# EAGLE design BQ25798 (EAGLE 9.6.2)
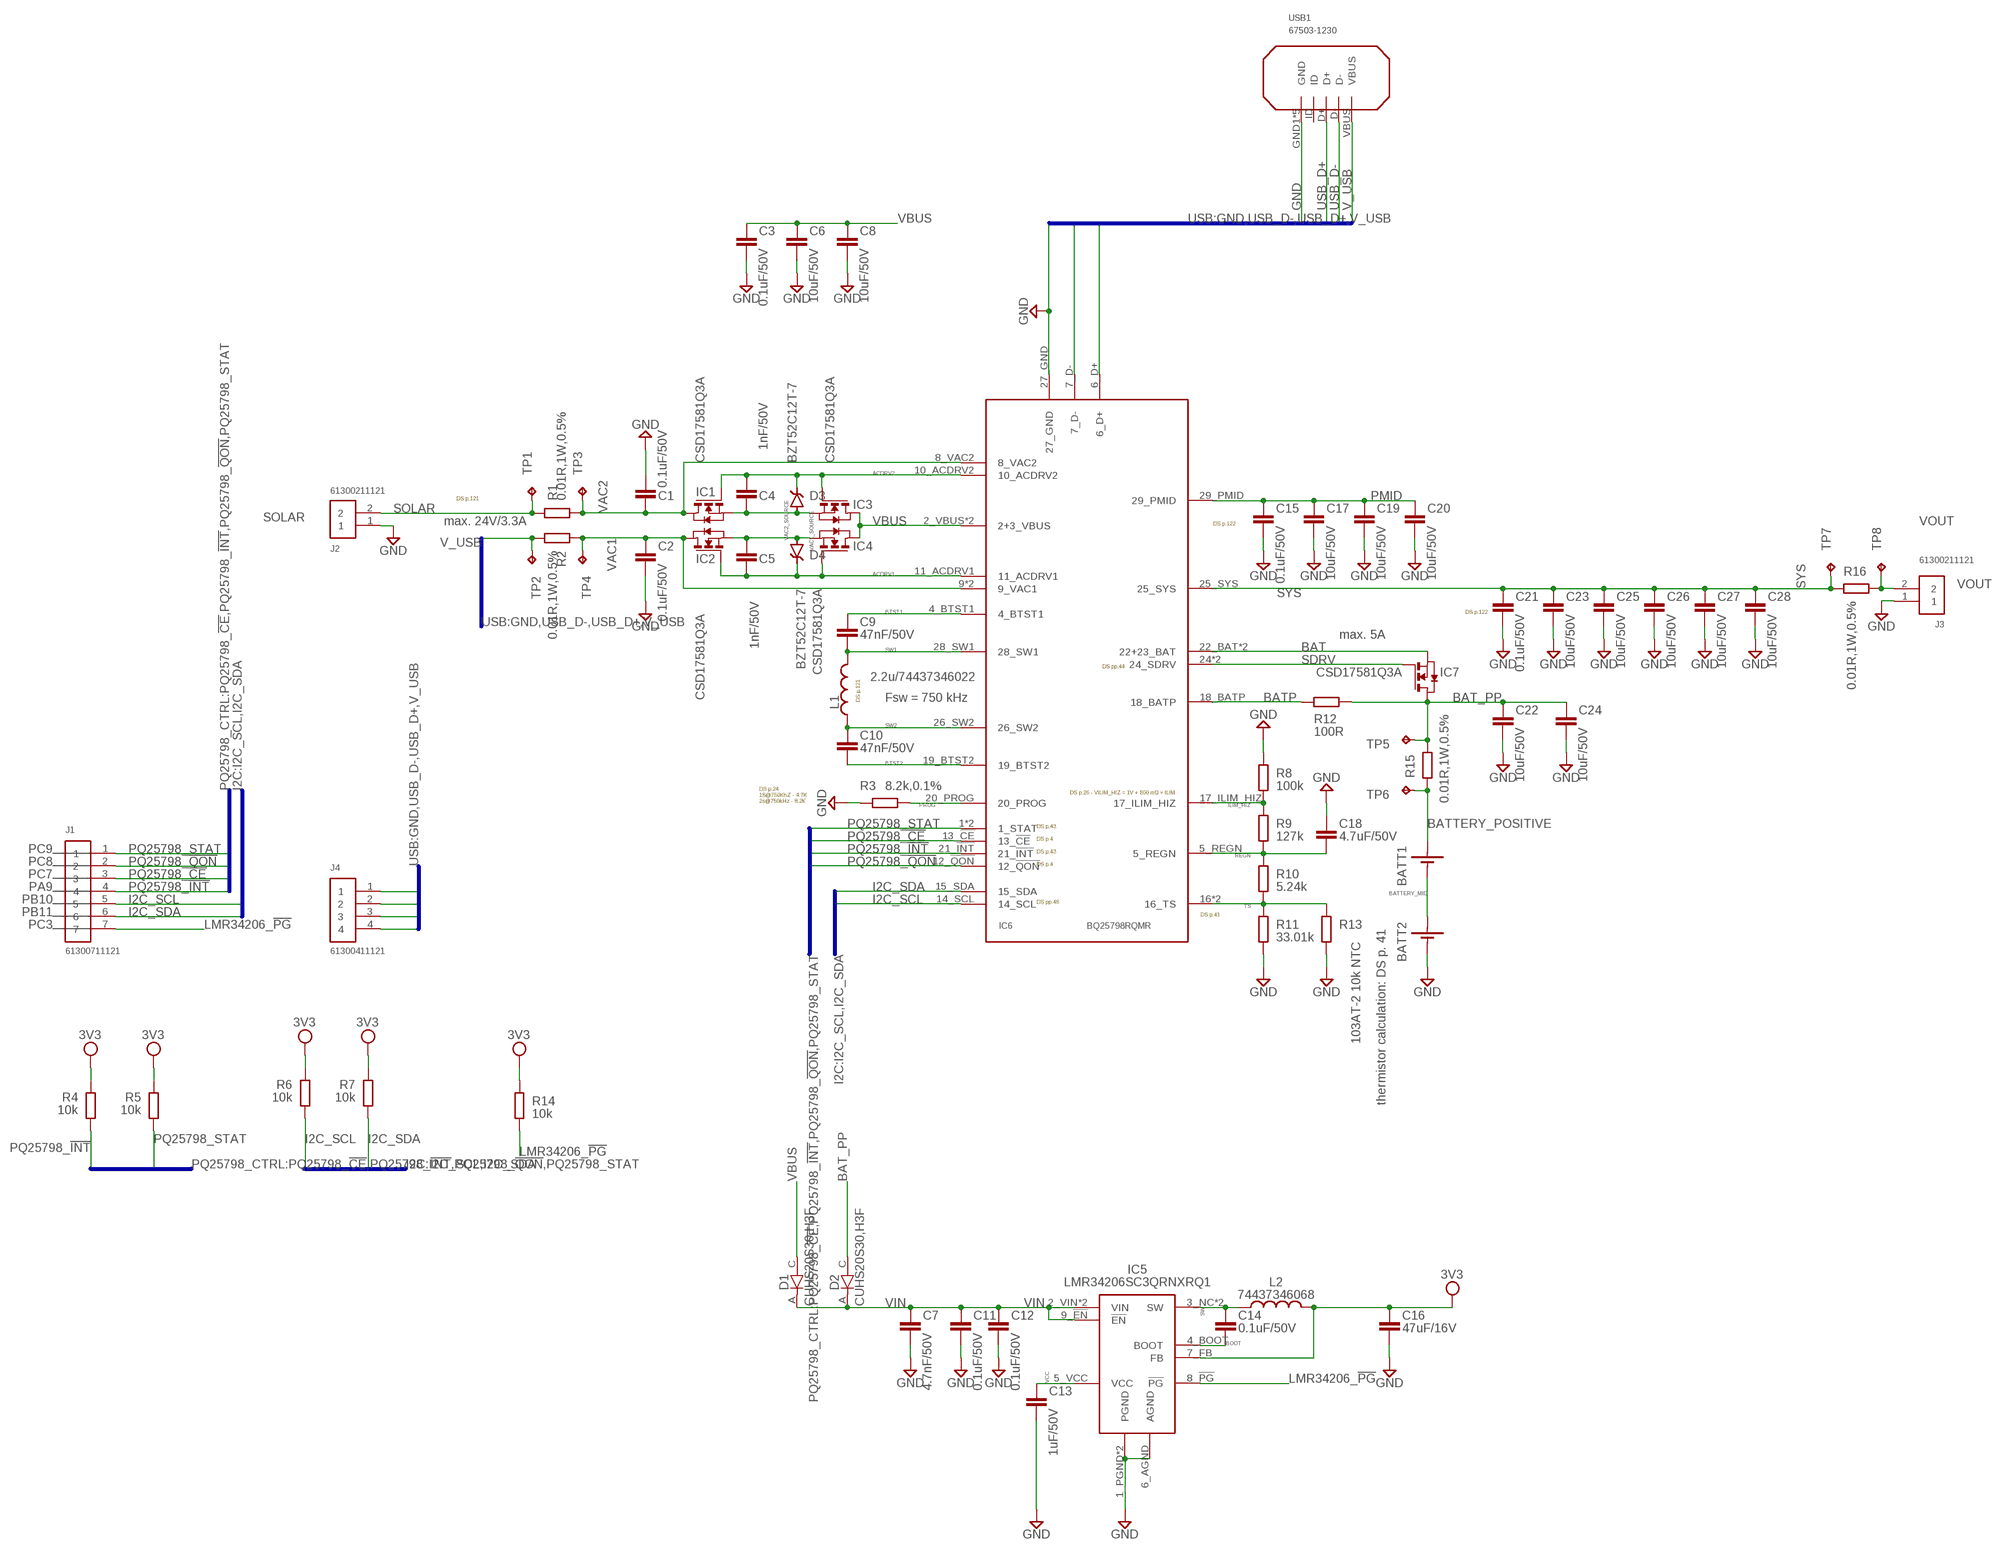
[diagram p0: schematic, sheet 1]

## Parts
BATT1  BATTERY  [TH]
BATT2  BATTERY  [TH]
C1  0.1uF/50V  C-EUC0402  [C0402]
C2  0.1uF/50V  C-EUC0402  [C0402]
C3  0.1uF/50V  C-EUC0402  [C0402]
C4  1nF/50V  C-EUC0402  [C0402]
C5  1nF/50V  C-EUC0402  [C0402]
C6  10uF/50V  C-EUC0805  [C0805]
C7  4.7nF/50V  C-EUC0805  [C0805]
C8  10uF/50V  C-EUC0805  [C0805]
C9  47nF/50V  C-EUC0603  [C0603]
C10  47nF/50V  C-EUC0603  [C0603]
C11  0.1uF/50V  C-EUC0402  [C0402]
C12  0.1uF/50V  C-EUC0402  [C0402]
C13  1uF/50V  C-EUC0805  [C0805]
C14  0.1uF/50V  C-EUC0402  [C0402]
C15  0.1uF/50V  C-EUC0402  [C0402]
C16  47uF/16V  C-EUC1206  [C1206]
C17  10uF/50V  C-EUC0805  [C0805]
C18  4.7uF/50V  C-EUC0603  [C0603]
C19  10uF/50V  C-EUC0805  [C0805]
C20  10uF/50V  C-EUC0805  [C0805]
C21  0.1uF/50V  C-EUC0402  [C0402]
C22  10uF/50V  C-EUC0805  [C0805]
C23  10uF/50V  C-EUC0805  [C0805]
C24  10uF/50V  C-EUC0805  [C0805]
C25  10uF/50V  C-EUC0805  [C0805]
C26  10uF/50V  C-EUC0805  [C0805]
C27  10uF/50V  C-EUC0805  [C0805]
C28  10uF/50V  C-EUC0805  [C0805]
D1  CUHS20S30,H3F  CUHS20S30  [US2H]
D2  CUHS20S30,H3F  CUHS20S30  [US2H]
D3  BZT52C12T-7  BZT52C2V0T  [SOD-523-2]
D4  BZT52C12T-7  BZT52C2V0T  [SOD-523-2]
IC1  CSD17581Q3A  [PQFN-12]
IC2  CSD17581Q3A  [PQFN-12]
IC3  CSD17581Q3A  [PQFN-12]
IC4  CSD17581Q3A  [PQFN-12]
IC5  LMR34206SC3QRNXRQ1  LMR34206-Q1  [VQFN-HR(12)]
IC6  BQ25798RQMR  BQ25798  [QFN29]
IC7  CSD17581Q3A  [PQFN-12]
J1  61300711121  [61300711121]
J2  61300211121  [61300211121]
J3  61300211121  [61300211121]
J4  61300411121  [61300411121]
L1  2.2u/74437346022  74437346022  [SMD]
L2  74437346068  74437346022  [SMD]
R1  0.01R,1W,0.5%  R-EU_R1206  [R1206]
R2  0.01R,1W,0.5%  R-EU_R1206  [R1206]
R3  8.2k,0.1%  R-EU_R0603  [R0603]
R4  10k  R-EU_R0402  [R0402]
R5  10k  R-EU_R0402  [R0402]
R6  10k  R-EU_R0402  [R0402]
R7  10k  R-EU_R0402  [R0402]
R8  100k  R-EU_R0402  [R0402]
R9  127k  R-EU_R0402  [R0402]
R10  5.24k  R-EU_R0402  [R0402]
R11  33.01k  R-EU_R0402  [R0402]
R12  100R  R-EU_R0603  [R0603]
R13  103AT-2 10k NTC  R-EU_V526-0  [V526-0]
R14  10k  R-EU_R0402  [R0402]
R15  0.01R,1W,0.5%  R-EU_R1206  [R1206]
R16  0.01R,1W,0.5%  R-EU_R1206  [R1206]
TP1  TPPAD1-13  [P1-13]
TP2  TPPAD1-13  [P1-13]
TP3  TPPAD1-13  [P1-13]
TP4  TPPAD1-13  [P1-13]
TP5  TPPAD1-13  [P1-13]
TP6  TPPAD1-13  [P1-13]
TP7  TPPAD1-13  [P1-13]
TP8  TPPAD1-13  [P1-13]
USB1  67503-1230  MX-67503-1230  [SMT]

## Nets
3V3 [3V3]: C16.1 IC5.7_FB(FB) L2.P$2 R4.2 R5.2 R6.2 R7.2 R14.1
ACDRV1 [signal]: C5.2 D4.C IC2.4_G(G) IC4.4_G(G) IC6.11_ACDRV1
ACDRV2 [signal]: C4.1 D3.C IC1.4_G(G) IC3.4_G(G) IC6.10_ACDRV2
BAT [V_USB]: IC6.22_BAT(22+23_BAT) IC6.23_BAT(22+23_BAT) IC7.1_S(S) IC7.2_S(S) IC7.3_S(S)
BAT_PP [V_USB]: C22.1 C24.1 D2.C IC7.5_D(D) IC7.6_D(D) IC7.7_D(D) IC7.8_D(D) IC7.9_D(D) R12.2 R15.2 TP5.TP
BATP [signal]: IC6.18_BATP R12.1
BATTERY_MID [V_USB]: BATT1.-(NEG) BATT2.+(POS)
BATTERY_POSITIVE [3V3]: BATT1.+(POS) R15.1 TP6.TP
BOOT [signal]: C14.2 IC5.4_BOOT(BOOT)
BTST1 [V_USB]: C9.1 IC6.4_BTST1
BTST2 [V_USB]: C10.2 IC6.19_BTST2
GND: BATT2.-(NEG) C1.1 C2.2 C3.2 C6.2 C7.2 C8.2 C11.2 C12.2 C13.2 C15.2 C16.2 C17.2 C18.1 C19.2 C20.2 C21.2 C22.2 C23.2 C24.2 C25.2 C26.2 C27.2 C28.2 IC5.1_PGND(PGND) IC5.6_AGND(AGND) IC5.11_PGND(PGND) IC6.27_GND J2.1 J3.1 J4.1 R3.1 R8.1 R11.2 R13.2 USB1.GND1(GND) USB1.GND2(GND) USB1.GND3(GND) USB1.GND4(GND) USB1.GND5(GND)
I2C_SCL [signal]: IC6.14_SCL J1.5 R6.1
I2C_SDA [signal]: IC6.15_SDA J1.6 R7.1
ILIM_HIZ [signal]: IC6.17_ILIM_HIZ R8.2 R9.1
LMR34206_!PG! [signal]: IC5.8_!PG!(!PG!) J1.7 R14.2
PMID [V_USB]: C15.1 C17.1 C19.1 C20.1 IC6.29_PMID
PQ25798_!CE! [signal]: IC6.13_!CE! J1.3
PQ25798_!INT! [signal]: IC6.21_!INT! J1.4 R4.1
PQ25798_!QON! [signal]: IC6.12_!QON! J1.2
PQ25798_STAT [signal]: IC6.1(1_STAT) IC6.1_STAT J1.1 R5.1
PROG [signal]: IC6.20_PROG R3.2
REGN [signal]: C18.2 IC6.5_REGN R9.2 R10.1
SDRV [signal]: IC6.24(24_SDRV) IC6.24_SDRV IC7.4_G(G)
SOLAR [V_USB]: J2.2 R1.1 TP1.TP
SW [3V3]: C14.1 IC5.3_NC(SW) IC5.12_SW(SW) L2.P$1
SW1 [V_USB]: C9.2 IC6.28_SW1 L1.P$2
SW2 [V_USB]: C10.1 IC6.26_SW2 L1.P$1
SYS [V_USB]: C21.1 C23.1 C25.1 C26.1 C27.1 C28.1 IC6.25_SYS R16.1 TP7.TP
TS [signal]: IC6.16(16_TS) IC6.16_TS R10.2 R11.1 R13.1
USB_D+ [signal]: IC6.6_D+ J4.2 USB1.D+
USB_D- [signal]: IC6.7_D- J4.3 USB1.D-
V_USB [V_USB]: J4.4 R2.1 TP2.TP USB1.VBUS
VAC1 [V_USB]: C2.1 IC2.5_D(D) IC2.6_D(D) IC2.7_D(D) IC2.8_D(D) IC2.9_D(D) IC6.9(9_VAC1) IC6.9_VAC1 R2.2 TP4.TP
VAC1_SOURCE [V_USB]: C5.1 D4.A IC2.1_S(S) IC2.2_S(S) IC2.3_S(S) IC4.1_S(S) IC4.2_S(S) IC4.3_S(S)
VAC2 [V_USB]: C1.2 IC1.5_D(D) IC1.6_D(D) IC1.7_D(D) IC1.8_D(D) IC1.9_D(D) IC6.8_VAC2 R1.2 TP3.TP
VAC2_SOURCE [V_USB]: C4.2 D3.A IC1.1_S(S) IC1.2_S(S) IC1.3_S(S) IC3.1_S(S) IC3.2_S(S) IC3.3_S(S)
VBUS [V_USB]: C3.1 C6.1 C8.1 D1.C IC3.5_D(D) IC3.6_D(D) IC3.7_D(D) IC3.8_D(D) IC3.9_D(D) IC4.5_D(D) IC4.6_D(D) IC4.7_D(D) IC4.8_D(D) IC4.9_D(D) IC6.2_VBUS(2+3_VBUS) IC6.3_VBUS(2+3_VBUS)
VCC [signal]: C13.1 IC5.5_VCC(VCC)
VIN [V_USB]: C7.1 C11.1 C12.1 D1.A D2.A IC5.2_VIN(VIN) IC5.9_!EN!(!EN!) IC5.10_VIN(VIN)
VOUT [3V3]: J3.2 R16.2 TP8.TP
Unconnected: USB1.ID

## Buses
I2C:I2C_SCL,I2C_SDA
PQ25798_CTRL:PQ25798_!CE!,PQ25798_!INT!,PQ25798_!QON!,PQ25798_STAT
USB:GND,USB_D-,USB_D+,V_USB

## Notes on the sheet
- DS p.121
- max. 24V/3.3A | DS p.122
- DS p.122
- max. 5A
- DS pp.44
- DS p.121 | Fsw = 750 kHz
- DS p.26 - VILIM_HIZ = 1V + 800 mΩ × ILIM
- DS p.24
  1S@750KhZ - 4.7K
  2s@750kHz - 8.2K
- DS p.43
- DS p.4
- PC9 | DS p.43
- PC8 | DS p.4
- PC7
- PA9
- PB10 | DS pp.48
- PB11 | DS p.41
- PC3 | thermistor calculation: DS p. 41

## Library data of the parts
BATT1 BATT2 = Battery:BATTERY
C1-C28 = rcl:C-EU: CAPACITOR, European symbol; SPICEPREFIX: C
D1 D2 = CUHS20S30 - Schottky Barrier Diode:CUHS20S30
D3 D4 = BZT52C2V0T - Zener diode:BZT52C2V0T
IC1-IC4 IC7 = CSD17581Q3A - N-MosFET:CSD17581Q3A
IC5 = LMR34206-Q1 - Synchronous Step-Down Converter:LMR34206-Q1
IC6 = BQ25798 - Battery Charger:BQ25798
J1 = Headers:61300711121: CONN HEADER VERT 7POS 2.54MM Manufacturer's datasheet <https://katalog.we-online.de/em/datasheet/6130xx11121.pdf>; CREATED_BY: PCBLayout.com; DIGI_KEY_PART_NUMBER: 732-5320-ND; MANUFACTURER: Wurth Electronics Inc.; MPN: 61300711121
J2 J3 = Headers:61300211121: CONN HEADER VERT 2POS 2.54MM Manufacturer's datasheet <https://katalog.we-online.de/em/datasheet/6130xx11121.pdf>; CREATED_BY: PCBLayout.com; DIGI_KEY_PART_NUMBER: 732-5315-ND; MANUFACTURER: Wurth Electronics Inc.; MPN: 61300211121
J4 = Headers:61300411121: CONN HEADER VERT 4POS 2.54MM Manufacturer's datasheet <https://katalog.we-online.de/em/datasheet/6130xx11121.pdf>; CREATED_BY: PCBLayout.com; DIGI_KEY_PART_NUMBER: 732-5317-ND; MANUFACTURER: Wurth Electronics Inc.; MPN: 61300411121
L1 L2 = 74437346022 - Power Inductor:74437346022
R1 R2 R4-R16 = rcl:R-EU_: RESISTOR, European symbol; SPICEPREFIX: R
R3 = rcl:R-EU_: RESISTOR, European symbol; MOUSER: 667-ERJ-PB6B8201V; SPICEPREFIX: R
TP1-TP8 = testpad:TP: Test pad
USB1 = MX-67503-1230 USB Mini-B SMT straight socket:MX-67503-1230

## Net classes
0 GND: width 0.35 mm, drill 0.35 mm, clearance 0.2 mm
1 V_USB: width 0.2 mm, drill 0.35 mm, clearance 0.2 mm
2 3V3: width 0.2 mm, drill 0.35 mm, clearance 0.2 mm
3 signal: width 0.2 mm, drill 0.35 mm, clearance 0.2 mm

## Board
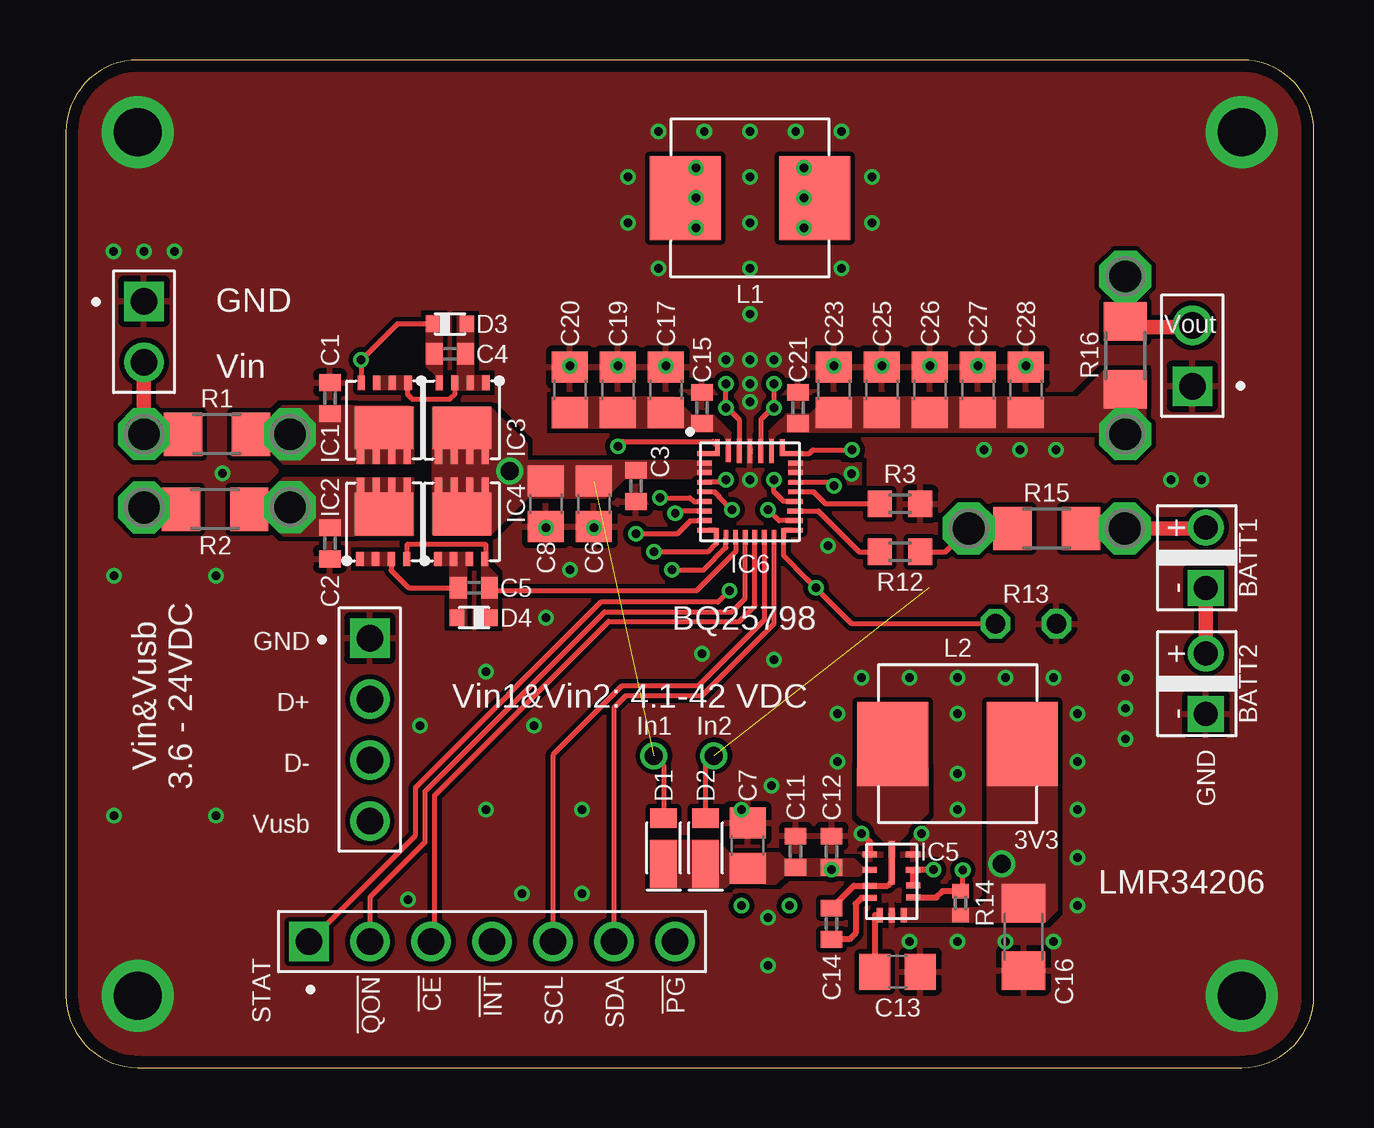
[diagram p1: board, top side]
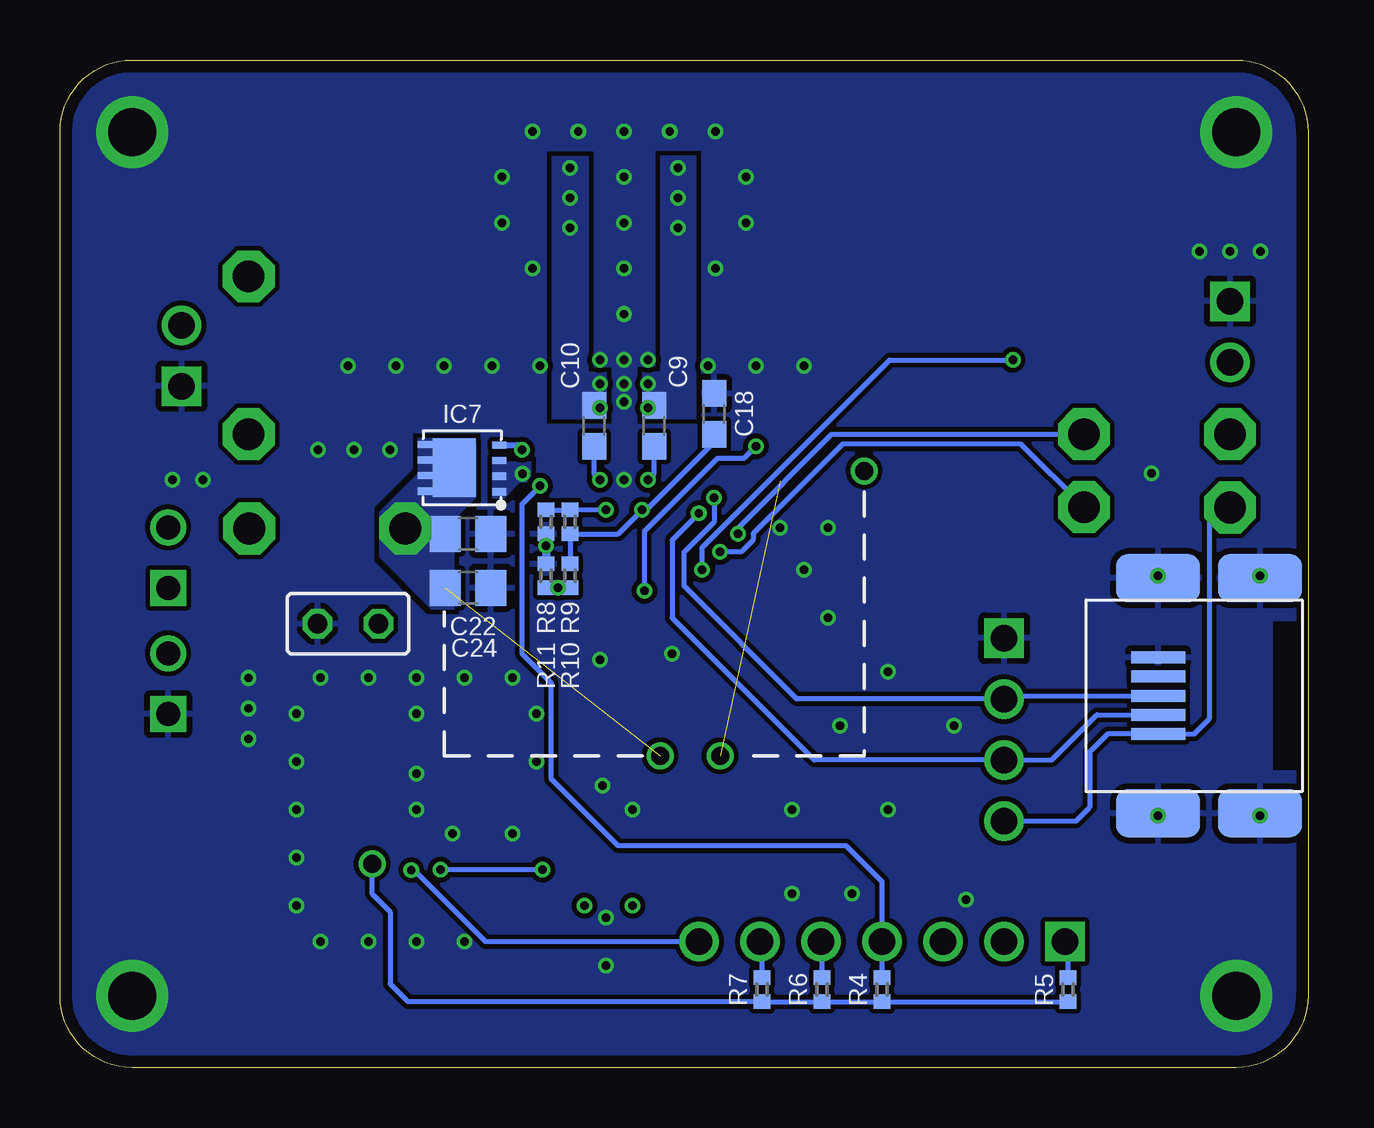
[diagram p2: board, bottom side, seen from below]

Size 52 x 42 mm. Coordinates in mm from the lower left corner, seen from the top.
Outline: 0,39 0,3 arc90 3,0 49,0 arc90 52,3 52,39 arc90 49,42 3,42 arc90 0,39
Copper layers (1*16): Top 0.035mm / dielectric 1.5mm / Bottom 0.035mm
Design rules "markovac_2layer": minimum track width 0.2mm, minimum drill 0.35mm, track to track 0.2mm, track to pad 0.2mm, pad to pad 0.2mm, via to via 0.2mm, smd to smd 0.2mm, copper to edge 0.5mm, drill to drill 8mil, minimum pad ring 0.15mm, minimum via ring 0.15mm, stop-mask expansion 4mil, vias tented up to drill 0.35mm, thermal gap 10mil

### Footprints (pad centres in the part's own frame; a part is rotated, then mirrored left to right if it is on the bottom)
TH = drill 1: + -1.27,0 | drill 1 square: - 1.27,0
C0402 = smd 0.7 x 0.9: 1 -0.65,0; 2 0.65,0
C0805 = smd 1.3 x 1.5: 1 -0.95,0; 2 0.95,0
C0603 = smd 1.1 x 1: 1 -0.85,0; 2 0.85,0
C1206 = smd 1.6 x 1.8: 1 -1.4,0; 2 1.4,0
US2H = smd 2 x 1.1: A -1,0 | smd 0.8 x 1.1: C 0.9,0
SOD-523-2 = smd 0.6 x 0.7: A 0.7,0; C -0.7,0
PQFN-12 = smd 0.3 x 0.6: 1_S -1,-1.55; 2_S -0.35,-1.55; 3_S 0.3,-1.55; 4_G 0.95,-1.55 | smd 0.3 x 0.635: 5_D 0.975,1.525; 6_D 0.325,1.525; 7_D -0.325,1.525; 8_D -0.975,1.525 | smd 2.45 x 1.775: 9_D 0,0.325
VQFN-HR(12) = smd 0.25 x 0.6: 1_PGND -1.135,-0.909; 2_VIN -0.485,-0.909; 3_NC 0.17,-0.911; 4_BOOT 0.67,-0.911; 8_!PG! 0.664,0.901; 9_!EN! 0.164,0.901; 10_VIN -0.485,0.899; 11_PGND -1.135,0.899 | smd 0.6 x 0.25: 5_VCC 1.402,-0.5; 6_AGND 1.4,0; 7_FB 1.402,0.5 | smd 1.825 x 0.25: 12_SW -0.788,0
QFN29 = smd 0.2 x 0.6: 1 -1.35,1.9; 9 -1.4,-1.9; 10_ACDRV2 -1,-1.9; 11_ACDRV1 -0.6,-1.9; 12_!QON! -0.2,-1.9; 13_!CE! 0.2,-1.9; 14_SCL 0.6,-1.9; 15_SDA 1,-1.9; 16 1.4,-1.9; 24 1.35,1.9 | smd 0.95 x 0.2: 1_STAT -1.725,1.6; 24_SDRV 1.725,1.6 | smd 0.6 x 0.2: 2_VBUS -1.9,1.2; 3_VBUS -1.9,0.8; 4_BTST1 -1.9,0.4; 5_REGN -1.9,0; 6_D+ -1.9,-0.4; 7_D- -1.9,-0.8; 8_VAC2 -1.9,-1.2; 20_PROG 1.9,0; 21_!INT! 1.9,0.4; 22_BAT 1.9,0.8; 23_BAT 1.9,1.2 | smd 0.9 x 0.2: 9_VAC1 -1.75,-1.6; 16_TS 1.75,-1.6 | smd 0.7 x 0.2: 17_ILIM_HIZ 1.85,-1.2 | smd 0.65 x 0.2: 18_BATP 1.875,-0.8 | smd 0.68 x 0.2: 19_BTST2 1.86,-0.4 | smd 0.2 x 1: 25_SYS 0.9,1.7; 26_SW2 0.45,1.7; 27_GND 0,1.7; 28_SW1 -0.45,1.7 | smd 0.2 x 0.95: 29_PMID -0.9,1.725
61300711121 = drill 1.1 square: 1 -7.62,0 | drill 1.1: 2 -5.08,0; 3 -2.54,0; 4 0,0; 5 2.54,0; 6 5.08,0; 7 7.62,0
61300211121 = drill 1.1 square: 1 -1.27,0 | drill 1.1: 2 1.27,0
61300411121 = drill 1.1 square: 1 -3.81,0 | drill 1.1: 2 -1.27,0; 3 1.27,0; 4 3.81,0
SMD = smd 2.95 x 3.5: P$1 -2.7,0; P$2 2.7,0
R1206 = smd 1.6 x 1.803: 1 -1.422,0; 2 1.422,0
R0603 = smd 1 x 1.1: 1 -0.85,0; 2 0.85,0
R0402 = smd 0.6 x 0.7: 1 -0.5,0; 2 0.5,0
V526-0 = drill 0.813 octagon: 1 -1.27,0; 2 1.27,0
P1-13 = drill 1.321 pad 2.159 octagon: TP 0,0
SMT = smd 2.25 x 0.5: D+ 0,0; D- 0,0.8; GND1 0,-1.6; ID 0,-0.8; VBUS 0,1.6 | smd 3.5 x 2: GND2 -4.25,-4.9; GND3 0,-4.9; GND4 0,4.9; GND5 -4.25,4.9

### Placement (x,y rotation side)
BATT1  47.5,21.25 270 top
BATT2  47.5,16 270 top
C1  11,27.9 270 top
C2  11,21.85 270 top
C3  23.75,24.25 270 top
C4  16,29.75 0 top
C5  17,20 0 top
C6  22,23.5 270 top
C7  28.4,9.25 90 top
C8  20,23.5 270 top
C9  27.25,26.75 90 bottom
C10  29.75,26.75 270 bottom
C11  30.4,9 90 top
C12  31.9,9 90 top
C13  34.65,4 0 top
C14  31.9,6 270 top
C15  26.5,27.5 90 top
C16  39.9,5.45 270 top
C17  25,28.25 90 top
C18  24.75,27.25 270 bottom
C19  23,28.25 90 top
C20  21,28.25 90 top
C21  30.5,27.5 90 top
C22  35,22.25 0 bottom
C23  32,28.25 90 top
C24  35,20 0 bottom
C25  34,28.25 90 top
C26  36,28.25 90 top
C27  38,28.25 90 top
C28  40,28.25 90 top
D1  24.9,9.5 90 top
D2  26.65,9.5 90 top
D3  16,31 0 top
D4  17,18.75 180 top
IC1  13.25,27 180 top
IC2  13.25,22.75 0 top
IC3  16.5,27 180 top
IC4  16.5,22.75 0 top
IC5  34.4,7.75 270 top
IC6  28.5,24 0 top
IC7  35.25,25 90 bottom
J1  17.75,5.25 0 top
J2  3.25,30.67 270 top
J3  46.93,29.67 90 top
J4  12.66,14.09 270 top
L1  28.5,36.25 180 top
L2  37.15,13.5 0 top
R1  6.29,26.4 0 top
R2  6.21,23.27 0 top
R3  34.75,23.5 180 top
R4  17.75,3.25 270 bottom
R5  10,3.25 270 bottom
R6  20.25,3.25 270 bottom
R7  22.75,3.25 270 bottom
R8  31.75,22.75 90 bottom
R9  30.75,22.75 270 bottom
R10  30.75,20.5 270 bottom
R11  31.75,20.5 90 bottom
R12  34.75,21.5 0 top
R13  40,18.5 180 bottom
R14  37.27,6.85 90 top
R15  40.86,22.47 180 top
R16  44.14,29.69 90 top
TP1  3.25,26.4 0 top
TP2  3.25,23.35 0 top
TP3  9.33,26.4 0 top
TP4  9.33,23.36 0 top
TP5  37.61,22.47 180 top
TP6  44.11,22.47 180 top
TP7  44.14,26.4 90 top
TP8  44.14,32.98 90 top
USB1  6.25,15.5 180 bottom

### Tracks (layer width: path | path; a pad name or v marks a point on that pad's centre or on a via)
3V3  (via drill 0.75)
  Bottom 0.2: R5.2 R4.2 R6.2 R7.2 37.5,2.75 38.25,3.5 38.25,6.5 39,7.25 v39,8.5
  pour Top (no thermals): 38.38,11.75 38.38,6.97 38.05,6.65 37.62,6.65 37.62,6.05 40.8,6.05 41.33,6.58 41.33,11.75
  pour Top (no thermals): 35.01,6.65 36.94,6.65 36.94,6.05 35.01,6.05
ACDRV1
  Top 0.2: IC6.11_ACDRV1 27.9,21.51 26.27,19.88 17.88,19.88 17.75,20 C5.2 | IC4.4_G 17.5,21.25 17.5,21.8 14.2,21.8 IC2.4_G
  pour Top (no thermals): 17.3,21.5 17.3,18.4 18,18.4 18,20.5 17.5,21 17.5,21.5
ACDRV2  (via drill 0.35)
  Top 0.2: IC1.4_G v12.3,29.5 13.8,31 D3.C | IC6.10_ACDRV2 27.5,21.68 26.57,20.75 v25.25,20.75
  Bottom 0.2: v25.25,20.75 25.25,21.68 17.43,29.5 v12.3,29.5
  pour Top (no thermals): 15.7,28.25 15.7,31.35 15,31.35 15,29.25 15.4,28.85 15.4,28.25
BAT  (via drill 0.35)
  other vias: 32.73,24.75
  pour Bottom (no thermals): 34,25.25 34,23.75 33.5,23.75 32.84,24.41 32.38,24.41 32.38,25.25
  pour Top (no thermals): 30.1,25.3 30.1,24.7 32.05,24.7 32.45,24.3 33.15,24.3 33.15,25.2 32.35,25.2 32.25,25.3
BAT_PP  (via drill 0.75)  (1 unrouted)
  Top 0.2: R12.2 36.64,21.5 TP5.TP | D2.C 26.65,12.65 v27,13
  Top 0.61: R15.2 TP5.TP
  Bottom 0.2: IC7.5_D 35.75,25.98 | 35.75,25.98 35.5,25.98 35.5,25.32 35.75,25.32 | 35.75,24.68 35.75,25.32 | 35.75,24.68 35.75,24.02 IC7.8_D 36.4,24.02 | 35.75,25.32 35.75,25.98 | 35.75,24.68 IC7.7_D 35.58,24.68 IC7.9_D | IC7.6_D 35.75,25.32 | C22.1 36.5,22.25
  pour Bottom (no thermals): 34.69,26.23 37.1,26.23 37.1,23.77 34.69,23.77
  pour Bottom (no thermals): 34.69,23.76 35.6,22.85 35.6,19.1 36.51,19.1 38.69,21.27 38.69,23.15 35.84,26 34.69,26
BATP
  Top 0.2: IC6.18_BATP 31.35,23.2 33.05,21.5 R12.1
BATTERY_MID
  Top 0.61: BATT1.- BATT2.+
BATTERY_POSITIVE
  Top 0.61: R15.1 TP6.TP 47.45,22.47 BATT1.+
BOOT
  Top 0.25: IC5.4_BOOT 33.15,7.08 32.9,6.83 32.9,5.6 32.65,5.35 C14.2
BTST1  (via drill 0.35)
  Top 0.2: v27.5,24.5 27.4,24.4 IC6.4_BTST1
  Bottom 0.2: v27.5,24.5 27.25,24.75 C9.1
BTST2  (via drill 0.35)
  Top 0.2: IC6.19_BTST2 29.9,23.6 29.5,24 v29.5,24.5
  Bottom 0.2: v29.5,24.5 29.75,24.75 C10.2
GND  (via drill 0.35, 2)
  Top 0.25: v33.15,9.75 33.49,9.41 IC5.1_PGND
  Top 0.35: C7.2 28.15,10.45 v28.15,10.75
  Bottom 0.35: R11.2 v31.75,21.75 R8.1
  other vias: 28.5,24.5 28.5,28.5 28.5,29.5 27.5,29.5 29.5,29.5 28.5,27.75 32,29.25 34,29.25 36,29.25 38,29.25 40,29.25 21,29.25 20,22.5 22,22.5 35.65,9.75 37.15,10.75 37.15,12.25 37.15,14.75 37.15,16.25 35.15,16.25 33.15,16.25 32.15,14.75 39.15,16.25 41.15,16.25 42.15,14.75 42.15,12.75 42.15,10.75 42.15,8.75 42.15,6.75 32.15,12.75 41.15,5.25 37.15,5.25 35.15,5.25 29.4,11.75 3,39 49,39 49,3 3,3 28.5,31.41 28.5,33.31 28.5,35.22 28.5,37.12 28.5,39.02 30.41,39.02 32.31,39.02 33.58,37.12 33.58,35.22 32.31,33.31 26.59,39.02 24.69,39.02 23.42,37.12 23.42,35.22 24.69,33.31 44.14,13.7 44.14,14.97 44.14,16.24 46.05,24.5 47.31,24.5 1.98,34.02 3.25,34.02 4.52,34.02 2,20.5 6.25,20.5 2,10.5 6.25,10.5 26.5,17.25 29.5,17 14.75,14.25 39.15,5.25 25,29.25 23,29.25 21.5,10.75 17.5,10.75 29.25,6.25 29.25,4.25 6.52,24.77 19.5,14.25 21,20.75 20,18.75 17.5,16.5 19,7.25 21.5,7.25 14.25,7 38.25,25.75 39.75,25.75 41.25,25.75
  pour Top (rank 2): 0,42 52,42 52,0 0,0
  pour Bottom (rank 2): 0,42 52,42 52,0 0,0
  pour Bottom (no thermals): 28,30.25 28,24 29,24 29,30.25
  pour Top (no thermals): 28,27.5 28,29 26.75,29 26.75,30.25 30.25,30.25 30.25,29 29,29 29,27.5
I2C_SCL
  Top 0.2: J1.5 20.29,13.03 23.16,15.9 26.33,15.9 29.1,18.67 IC6.14_SCL
  Bottom 0.2: R6.1 20.25,5.21 J1.5
I2C_SDA
  Top 0.2: J1.6 22.83,15 23.33,15.5 26.5,15.5 29.5,18.5 IC6.15_SDA
  Bottom 0.2: R7.1 22.75,5.17 J1.6
ILIM_HIZ  (via drill 0.35)
  Top 0.2: IC6.17_ILIM_HIZ 29.7,22.8 v29.25,23.25
  Bottom 0.2: v29.25,23.25 R9.1 R8.2
LMR34206_!PG!  (via drill 0.35)
  Top 0.2: R14.2 37.37,7.44 v37.37,8.23
  Top 0.25: R14.2 36.52,7.35 36.26,7.09 IC5.8_!PG!
  Bottom 0.2: v37.37,8.23 37.25,8.23 34.27,5.25 J1.7
N$3  (via drill 0.35)
  other vias: 28.15,6.75
N$4  (via drill 0.35)
  other vias: 30.15,6.75
PMID
  pour Top (no thermals): 20.25,26.65 27,26.65 27,27.2 26.1,27.2 25.35,27.95 20.25,27.95
  pour Top (no thermals): 27.7,26.2 27.5,26.2 27.2,26.5 27,26.5 27,27.2 27.7,26.5
PQ25798_!CE!
  Top 0.2: IC6.13_!CE! 28.7,19.24 28.06,18.6 22.61,18.6 15.37,11.35 15.37,5.41 J1.3
PQ25798_!INT!  (via drill 0.35)
  Top 0.2: IC6.21_!INT! 31.85,24.4 v32,24.25
  Bottom 0.2: v32,24.25 32.75,23.5 32.75,17.25 31.52,16.02 31.52,12.03 28.75,9.25 19.25,9.25 17.75,7.75 J1.4 R4.1
PQ25798_!QON!
  Top 0.2: IC6.12_!QON! 28.3,19.55 27.75,19 22.45,19 14.96,11.52 14.96,9.4 12.67,7.1 J1.2
PQ25798_STAT  (via drill 0.35)
  Top 0.2: IC6.1_STAT 27.15,25.6 IC6.1 26.95,26.1 23.2,26.1 v23,25.9 | v27.65,19.88 27.18,19.4 22.28,19.4 14.56,11.69 14.56,9.69 J1.1
  Bottom 0.2: v27.65,19.88 27.65,22.35 24.6,25.4 23.5,25.4 v23,25.9 | R5.1 10,5.12 J1.1
PROG
  Top 0.2: R3.2 31.65,23.5 31.15,24 IC6.20_PROG
REGN  (via drill 0.35)
  Top 0.2: IC6.5_REGN 27.02,24 27.2,23.82 27.2,23.8 v27.75,23.25
  Bottom 0.2: R10.1 R9.2 28.75,22.25 v27.75,23.25 27.57,23.25 24.75,26.07 C18.2
SDRV  (via drill 0.35)
  Top 0.2: v32.75,25.75 31.12,25.75 30.98,25.6 IC6.24_SDRV 29.85,25.6 IC6.24
  Bottom 0.2: 32.95,25.95 v32.75,25.75
  Bottom 0.254: IC7.4_G 32.95,25.95
SOLAR
  Top 0.2: R1.1 TP1.TP
  Top 0.61: J2.2 TP1.TP
SW
  Top 0.2: 34.4,7.75 IC5.12_SW
  Top 0.25: C14.1 32.83,7.58 IC5.3_NC 34.23,7.58 34.4,7.75
  pour Top (no thermals): 34.27,8.75 34.27,9.22 32.98,10.53 32.98,12.5 35.92,12.5 35.92,10.62 34.52,9.22 34.52,8.75
SW1  (via drill 0.35)
  Top 0.2: L1.P$2 v26.25,36.25 | IC6.28_SW1 28.05,27.02 27.57,27.5 v27.5,27.5 v27.5,28.5
  other vias: 26.25,37.5 26.25,35
  pour Bottom (no thermals): 25.5,27.05 25.5,38 27,38 27,29 27.75,29 27.75,27.05
SW2  (via drill 0.35)
  Top 0.2: L1.P$1 v30.75,36.25 | IC6.26_SW2 28.95,27.02 29.43,27.5 v29.5,27.5 v29.5,28.5
  other vias: 30.75,35 30.75,37.5
  pour Bottom (no thermals): 31.5,38 30,38 30,29 29.25,29 29.25,27.04 31.5,27.04
SYS
  pour Top (no thermals): 30,26.5 45.01,26.5 45.01,29.05 43.23,29.05 42.13,27.95 31.5,27.95 31.5,27.75 31,27.25 30,27.25
  pour Top (no thermals): 29.3,26.2 29.3,26.55 30,27.25 30,26.5 29.8,26.5 29.5,26.2
TS  (via drill 0.35)
  Top 0.2: IC6.16_TS 29.9,22.4 IC6.16 29.9,21.35 30.88,20.38 v31.25,20 32.75,18.5 R13.1
  Bottom 0.2: R10.2 v31.25,20 R11.1
USB_D+  (via drill 0.35)
  Top 0.2: v24.75,23.75 26,23.75 26.15,23.6 IC6.6_D+
  Bottom 0.2: v24.75,23.75 24.75,22.75 26,21.5 26,20.07 21.29,15.36 J4.2 12.64,15.36 12.5,15.5 USB1.D+
USB_D-  (via drill 0.35)
  Top 0.2: IC6.7_D- 25.49,23.2 v25.39,23.1
  Bottom 0.2: v25.39,23.1 26.5,21.99 26.5,18.75 20.57,12.82 J4.3 10.68,12.82 8.8,14.7 USB1.D-
V_USB
  Top 0.2: R2.1 3.33,23.27 TP2.TP
  Bottom 0.2: TP2.TP 4.12,23.35 4.12,14.53 4.75,13.9 USB1.VBUS 8.35,13.9 9.1,13.15 9.1,10.85 9.66,10.28 J4.4
VAC1  (via drill 0.35)
  Top 0.2: IC6.9_VAC1 27.1,22.4 IC6.9 27.1,21.84 26.76,21.5 v24.5,21.5
  Bottom 0.2: TP4.TP 11.97,26 19.38,26 23.12,22.26 23.12,21.99 23.62,21.5 v24.5,21.5
  pour Top (no thermals): 12,24.6 14.5,24.6 14.5,22.15 12,22.15
  pour Top (no thermals): 12,24.6 9.05,24.6 8.06,23.61 6.95,23.61 6.95,22.93 8.28,22.93 9.05,22.15 12,22.15
VAC1_SOURCE
  Top 0.2: IC2.3_S 13.55,20.73 14.28,20 C5.1
  pour Top (no thermals): 12.1,21.5 13.7,21.5 13.7,20.9 12.1,20.9
  pour Top (no thermals): 16.7,20.9 16.7,18.4 16,18.4 16,20.9
  pour Top (no thermals): 15.35,21.5 16.95,21.5 16.95,20.9 15.35,20.9
VAC2  (via drill 0.35)
  Top 0.2: IC6.8_VAC2 26.03,22.8 25.48,22.25 v23.75,22.25
  Bottom 0.2: TP3.TP 19.85,26.4 23.75,22.5 v23.75,22.25
  pour Top (no thermals): 12,27.6 14.5,27.6 14.5,25.15 12,25.15
  pour Top (no thermals): 12,27.6 9.03,27.6 8.18,26.75 7,26.75 7,26.05 8.15,26.05 9.05,25.15 12,25.15
VAC2_SOURCE
  Top 0.2: IC1.1_S 14.25,28.05 14.44,27.86 16,27.86 16.2,28.06 IC3.3_S
  pour Top (no thermals): 12.8,28.85 14.4,28.85 14.4,28.25 12.8,28.25
  pour Top (no thermals): 16.05,28.25 17.65,28.25 17.65,28.85 16.05,28.85
  pour Top (no thermals): 16.3,28.85 16.3,31.35 17,31.35 17,28.85
VBUS  (via drill 0.75)  (1 unrouted)
  Top 0.2: 23.85,25 C3.1 | v24.5,13 24.9,12.6 D1.C
  other vias: 18.5,24.88
  pour Top (no thermals): 26.9,24.7 26.9,25.3 19.25,25.3 19.25,23.75 22.5,23.75 23.3,24.55 26.05,24.55 26.2,24.7
  pour Top (no thermals): 15.25,27.5 15.25,22.25 17.75,22.25 19.25,23.75 19.25,26 17.75,27.5
VCC
  Top 0.25: IC5.5_VCC 33.7,6.35 C13.1
VIN  (via drill 0.35)
  Top 0.2: IC5.9_!EN! | IC5.10_VIN
  Top 0.25: IC5.9_!EN! IC5.10_VIN | IC5.10_VIN 36.14,8.24 v36.15,8.25
  Bottom 0.2: v31.9,8.25 v36.15,8.25
  pour Top (no thermals): 29.11,8.95 29.11,7.65 29.6,7.65 29.95,8 33.09,8 33.2,8.11 33.2,8.36 32.86,8.7 29.96,8.7 29.71,8.95
  pour Top (no thermals): 24.35,9.5 27.1,9.5 27.68,8.93 27.68,7.67 27.5,7.5 24.35,7.5
VOUT
  Top 0.61: TP8.TP R16.2 44.39,30.86 46.85,30.86 J3.2

### Text on the board
tPlace: GND | Vout | Vin | BQ25798 | GND | Vin&Vusb / 3.6 - 24VDC | Vin1&Vin2: 4.1-42 VDC | D+ | In1 | In2 | D- | GND | Vusb | 3V3 | LMR34206 | STAT | !QON! | !CE! | !INT! | SCL | SDA | !PG!
tStop: ejovrh rev.1